# Altium schematic sheet Public_CPU_QSGMII_ETHERNET.SchDoc
size D
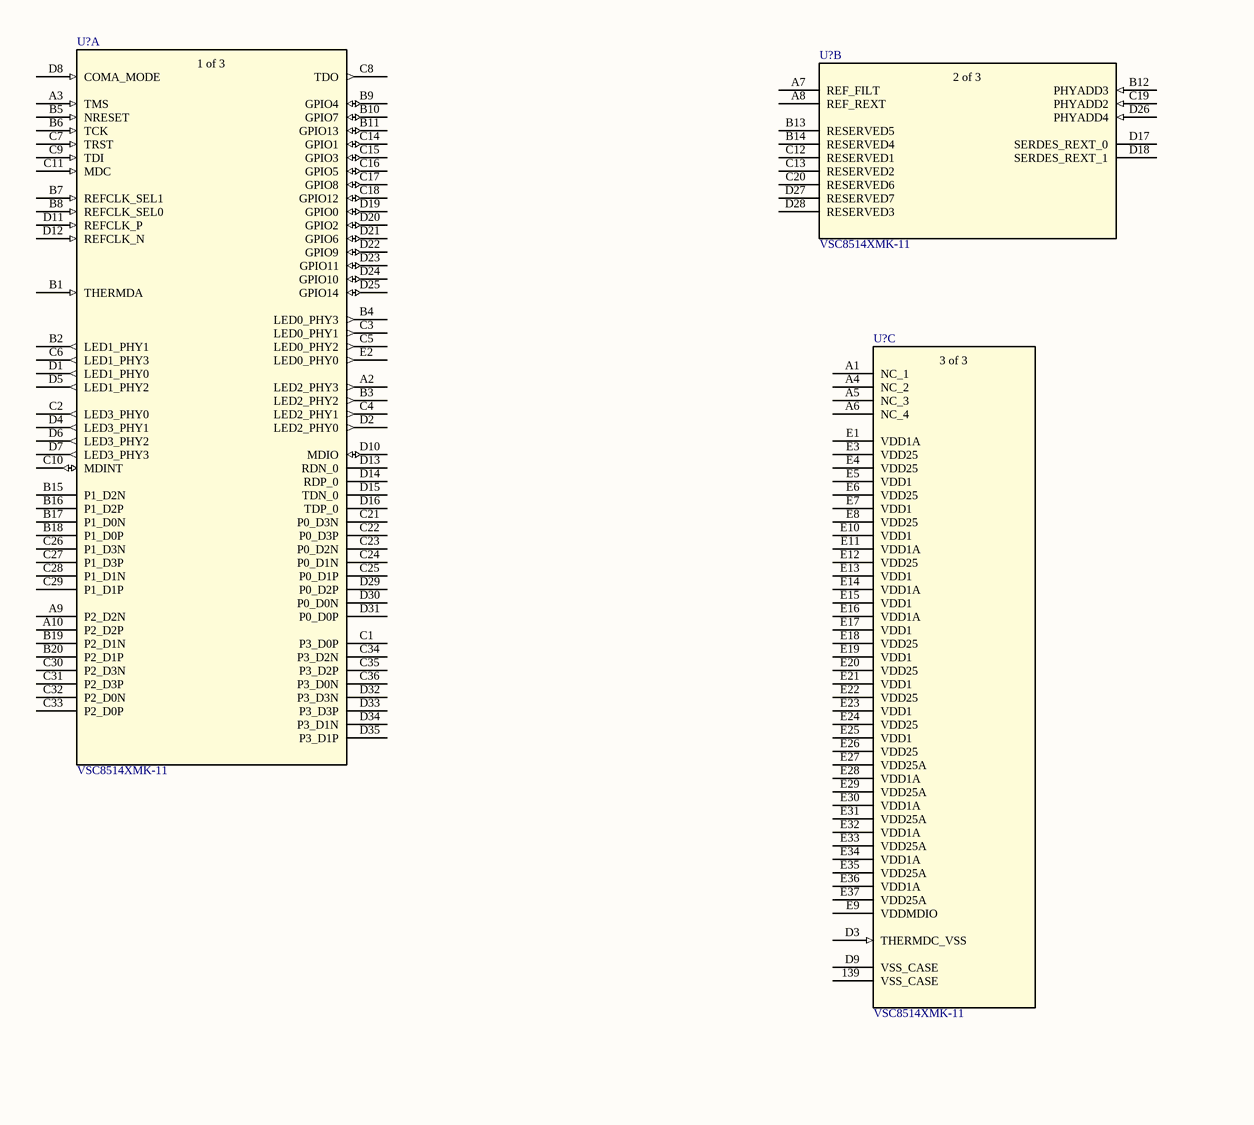
[diagram p0: Public_CPU_QSGMII_ETHERNET.SchDoc, left]
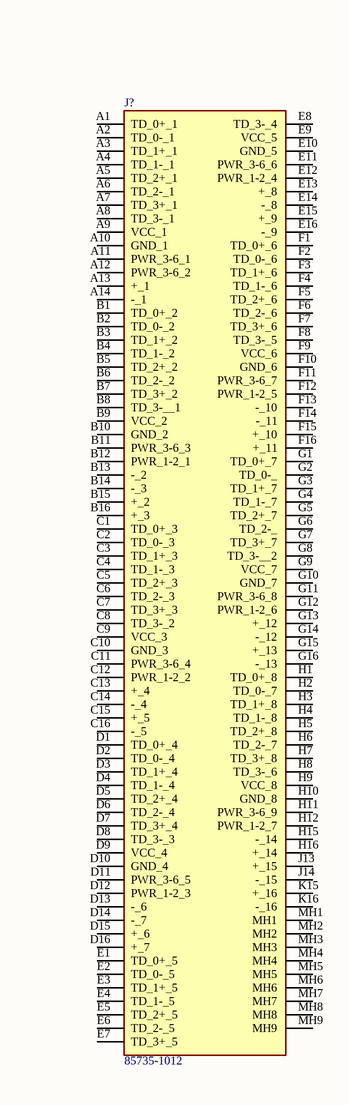
[diagram p1: Public_CPU_QSGMII_ETHERNET.SchDoc, right]

## Parts
(Parts that share a designator on the sheet are numbered #1, #2 ... from top to bottom, then left to right.)
J?  85735-1012  [857351012]
U?#1  VSC8514XMK-11  [QFN138_12X12X0P85_MCH]  (part A of 3)
U?#2  VSC8514XMK-11  [QFN138_12X12X0P85_MCH]  (part B of 3)
U?#3  VSC8514XMK-11  [QFN138_12X12X0P85_MCH]  (part C of 3)

## Nets

Not connected (* = marked no-connect by the designer): J? A1(TD_0+_1) A2(TD_0-_1) A3(TD_1+_1) A4(TD_1-_1) A5(TD_2+_1) A6(TD_2-_1) A7(TD_3+_1) A8(TD_3-_1) A9(VCC_1) A10(GND_1) A11(PWR_3-6_1) A12(PWR_3-6_2) A13(+_1) A14(-_1) B1(TD_0+_2) B2(TD_0-_2) B3(TD_1+_2) B4(TD_1-_2) B5(TD_2+_2) B6(TD_2-_2) B7(TD_3+_2) B8(TD_3-__1) B9(VCC_2) B10(GND_2) B11(PWR_3-6_3) B12(PWR_1-2_1) B13(-_2) B14(-_3) B15(+_2) B16(+_3) C1(TD_0+_3) C2(TD_0-_3) C3(TD_1+_3) C4(TD_1-_3) C5(TD_2+_3) C6(TD_2-_3) C7(TD_3+_3) C8(TD_3-_2) C9(VCC_3) C10(GND_3) C11(PWR_3-6_4) C12(PWR_1-2_2) C13(+_4) C14(-_4) C15(+_5) C16(-_5) D1(TD_0+_4) D2(TD_0-_4) D3(TD_1+_4) D4(TD_1-_4) D5(TD_2+_4) D6(TD_2-_4) D7(TD_3+_4) D8(TD_3-_3) D9(VCC_4) D10(GND_4) D11(PWR_3-6_5) D12(PWR_1-2_3) D13(-_6) D14(-_7) D15(+_6) D16(+_7) E1(TD_0+_5) E2(TD_0-_5) E3(TD_1+_5) E4(TD_1-_5) E5(TD_2+_5) E6(TD_2-_5) E7(TD_3+_5) E8(TD_3-_4) E9(VCC_5) E10(GND_5) E11(PWR_3-6_6) E12(PWR_1-2_4) E13(+_8) E14(-_8) E15(+_9) E16(-_9) F1(TD_0+_6) F2(TD_0-_6) F3(TD_1+_6) F4(TD_1-_6) F5(TD_2+_6) F6(TD_2-_6) F7(TD_3+_6) F8(TD_3-_5) F9(VCC_6) F10(GND_6) F11(PWR_3-6_7) F12(PWR_1-2_5) F13(-_10) F14(-_11) F15(+_10) F16(+_11) G1(TD_0+_7) G2(TD_0-_) G3(TD_1+_7) G4(TD_1-_7) G5(TD_2+_7) G6(TD_2-_) G7(TD_3+_7) G8(TD_3-__2) G9(VCC_7) G10(GND_7) G11(PWR_3-6_8) G12(PWR_1-2_6) G13(+_12) G14(-_12) G15(+_13) G16(-_13) H1(TD_0+_8) H2(TD_0-_7) H3(TD_1+_8) H4(TD_1-_8) H5(TD_2+_8) H6(TD_2-_7) H7(TD_3+_8) H8(TD_3-_6) H9(VCC_8) H10(GND_8) H11(PWR_3-6_9) H12(PWR_1-2_7) H15(-_14) H16(+_14) J13(+_15) J14(-_15) K15(+_16) K16(-_16) MH1 MH2 MH3 MH4 MH5 MH6 MH7 MH8 MH9; U?#1 A2(LED2_PHY3) A3(TMS) A9(P2_D2N) A10(P2_D2P) B1(THERMDA) B2(LED1_PHY1) B3(LED2_PHY2) B4(LED0_PHY3) B5(NRESET) B6(TCK) B7(REFCLK_SEL1) B8(REFCLK_SEL0) B9(GPIO4) B10(GPIO7) B11(GPIO13) B15(P1_D2N) B16(P1_D2P) B17(P1_D0N) B18(P1_D0P) B19(P2_D1N) B20(P2_D1P) C1(P3_D0P) C2(LED3_PHY0) C3(LED0_PHY1) C4(LED2_PHY1) C5(LED0_PHY2) C6(LED1_PHY3) C7(TRST) C8(TDO) C9(TDI) C10(MDINT) C11(MDC) C14(GPIO1) C15(GPIO3) C16(GPIO5) C17(GPIO8) C18(GPIO12) C21(P0_D3N) C22(P0_D3P) C23(P0_D2N) C24(P0_D1N) C25(P0_D1P) C26(P1_D3N) C27(P1_D3P) C28(P1_D1N) C29(P1_D1P) C30(P2_D3N) C31(P2_D3P) C32(P2_D0N) C33(P2_D0P) C34(P3_D2N) C35(P3_D2P) C36(P3_D0N) D1(LED1_PHY0) D2(LED2_PHY0) D4(LED3_PHY1) D5(LED1_PHY2) D6(LED3_PHY2) D7(LED3_PHY3) D8(COMA_MODE) D10(MDIO) D11(REFCLK_P) D12(REFCLK_N) D13(RDN_0) D14(RDP_0) D15(TDN_0) D16(TDP_0) D19(GPIO0) D20(GPIO2) D21(GPIO6) D22(GPIO9) D23(GPIO11) D24(GPIO10) D25(GPIO14) D29(P0_D2P) D30(P0_D0N) D31(P0_D0P) D32(P3_D3N) D33(P3_D3P) D34(P3_D1N) D35(P3_D1P) E2(LED0_PHY0); U?#2 A7(REF_FILT) A8(REF_REXT) B12(PHYADD3) B13(RESERVED5) B14(RESERVED4) C12(RESERVED1) C13(RESERVED2) C19(PHYADD2) C20(RESERVED6) D17(SERDES_REXT_0) D18(SERDES_REXT_1) D26(PHYADD4) D27(RESERVED7) D28(RESERVED3); U?#3 139(VSS_CASE) A1(NC_1) A4(NC_2) A5(NC_3) A6(NC_4) D3(THERMDC_VSS) D9(VSS_CASE) E1(VDD1A) E3(VDD25) E4(VDD25) E5(VDD1) E6(VDD25) E7(VDD1) E8(VDD25) E9(VDDMDIO) E10(VDD1) E11(VDD1A) E12(VDD25) E13(VDD1) E14(VDD1A) E15(VDD1) E16(VDD1A) E17(VDD1) E18(VDD25) E19(VDD1) E20(VDD25) E21(VDD1) E22(VDD25) E23(VDD1) E24(VDD25) E25(VDD1) E26(VDD25) E27(VDD25A) E28(VDD1A) E29(VDD25A) E30(VDD1A) E31(VDD25A) E32(VDD1A) E33(VDD25A) E34(VDD1A) E35(VDD25A) E36(VDD1A) E37(VDD25A)

## Notes on the sheet
- Title
- Size:
- Date:
- File:
- D
- Number:
- Time:
- Revision:
- Sheet
- of
- (in symbol VSC8514XMK-11, part A) 1 of 3
- (in symbol VSC8514XMK-11, part B) 2 of 3
- (in symbol VSC8514XMK-11, part C) 3 of 3

## Library data of the parts
J? = 85735-1012: Connector; Manufacturer_Name: Molex; Datasheet Link: https://www.molex.com/pdm_docs/sd/857351012_sd.pdf; Height: 25.71mm; Manufacturer_Part_Number: 85735-1012; Mouser Part Number: N/A; Mouser Price/Stock: https://www.mouser.co.uk/ProductDetail/Molex/85735-1012?qs=yd8XiKYcH9lIdOAreapLrg%3D%3D
U?#1-U?#3 = VSC8514XMK-11: No Description Available; SourceLibrary: Microchip_2020-10-14; Built_By: EMA_Cory; Vendor: Microchip; Datasheet: https://ww1.microchip.com/downloads/en/DeviceDoc/VMDS-10446.pdf; Copyright: Copyright (C) 2018 Accelerated Designs. All rights reserved; Manufacturer_Part_Number: VSC8514XMK-11; RefDes: RefDes; Type: DEV